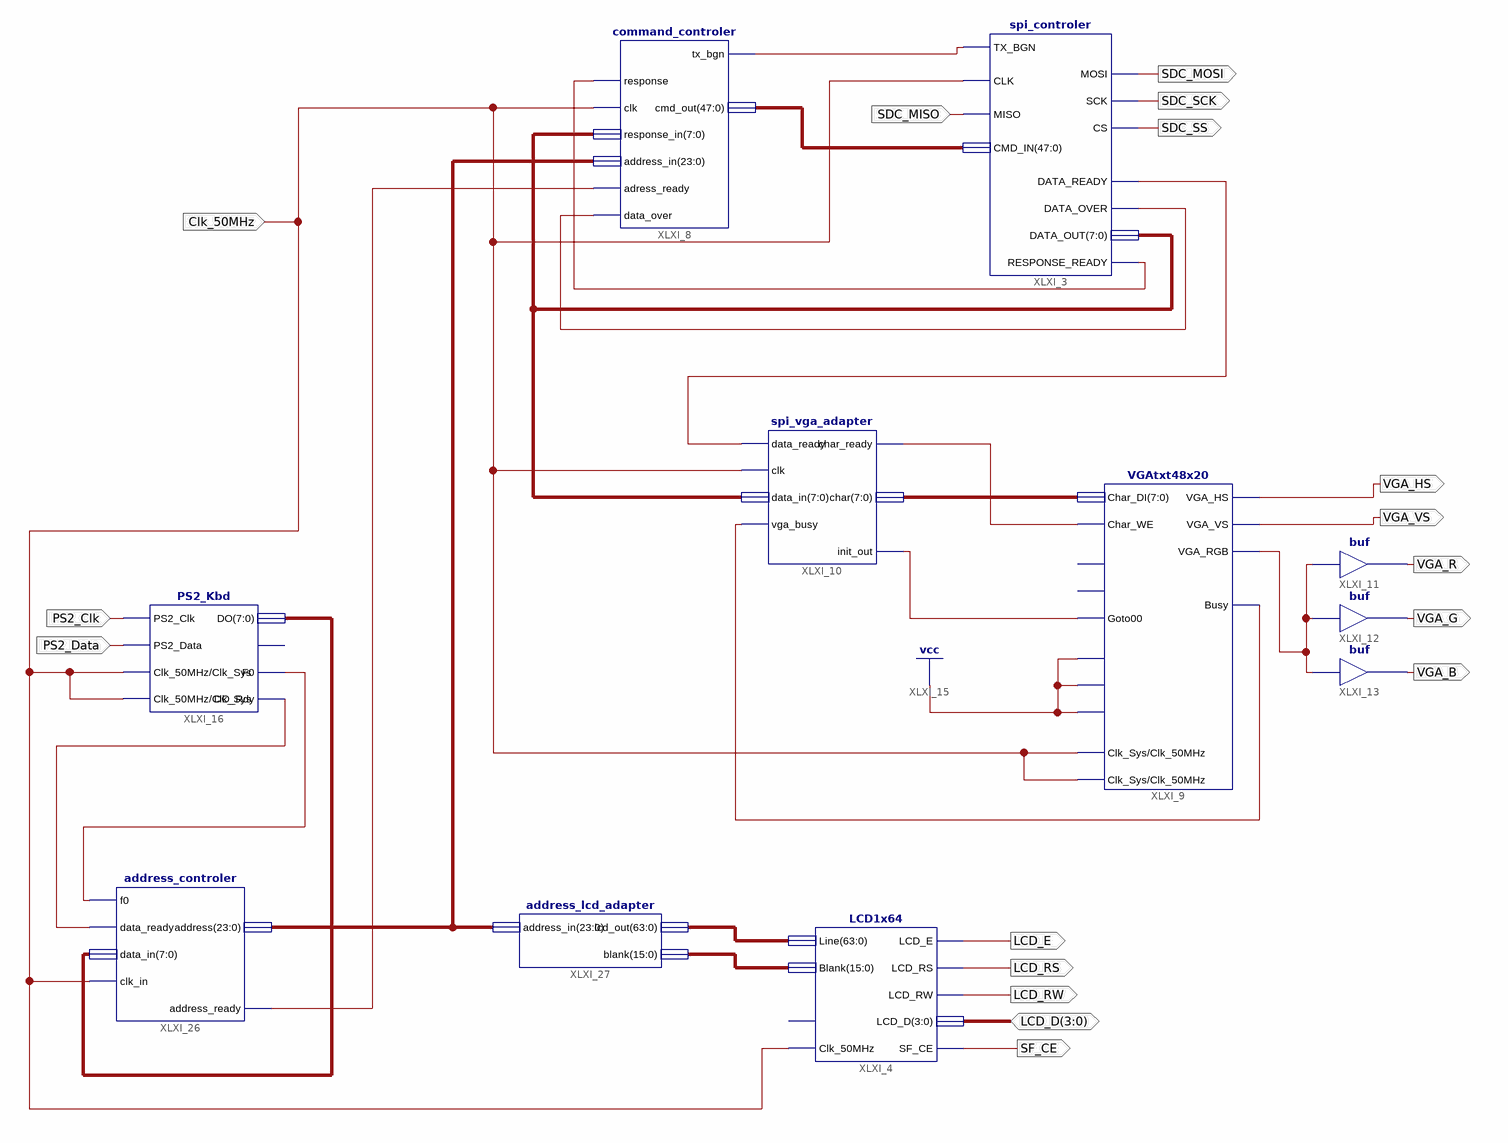
[diagram p0: schematic sheet 1]
// Xilinx ISE schematic main_full.sch (spartan3e) as structural Verilog: 11 symbols, 17 ports
module main_full (
  input  Clk_50MHz,
  input  SDC_MISO,
  input  PS2_Data,
  input  PS2_Clk,
  inout  [3:0] LCD_D,
  output VGA_B,
  output VGA_G,
  output VGA_R,
  output VGA_VS,
  output VGA_HS,
  output SDC_SS,
  output SDC_SCK,
  output SDC_MOSI,
  output LCD_E,
  output LCD_RS,
  output LCD_RW,
  output SF_CE
);

  wire XLXN_44, XLXN_52, XLXN_62, XLXN_169, XLXN_187, XLXN_229, XLXN_230, XLXN_232, XLXN_233, XLXN_284,
       XLXN_285;
  wire [7:0] XLXN_23, XLXN_45, XLXN_234;
  wire [15:0] XLXN_25;
  wire [23:0] XLXN_327;
  wire [47:0] XLXN_186;
  wire [63:0] XLXN_24;

  buf XLXI_12 (VGA_G, XLXN_52);
  buf XLXI_13 (VGA_B, XLXN_52);
  buf XLXI_11 (VGA_R, XLXN_52);
  VGAtxt48x20 XLXI_9 (
    .Char_DI(XLXN_45), .Goto00(XLXN_62), .Clk_Sys(Clk_50MHz), .Clk_50MHz(Clk_50MHz), .CursorOn(1'b1),
    .ScrollEn(1'b1), .ScrollClear(1'b1), .Busy(XLXN_169), .VGA_HS(VGA_HS), .VGA_VS(VGA_VS),
    .VGA_RGB(XLXN_52), .Char_WE(XLXN_44));  // open: Home, NewLine
  spi_vga_adapter XLXI_10 (
    .data_ready(XLXN_229), .vga_busy(XLXN_169), .clk(Clk_50MHz), .data_in(XLXN_23), .char_ready(XLXN_44),
    .char(XLXN_45), .init_out(XLXN_62));
  command_controler XLXI_8 (
    .response(XLXN_230), .adress_ready(XLXN_284), .data_over(XLXN_285), .clk(Clk_50MHz),
    .response_in(XLXN_23), .address_in(XLXN_327), .tx_bgn(XLXN_187), .cmd_out(XLXN_186));
  spi_controler XLXI_3 (
    .TX_BGN(XLXN_187), .CLK(Clk_50MHz), .MISO(SDC_MISO), .CMD_IN(XLXN_186), .RESPONSE_READY(XLXN_230),
    .DATA_READY(XLXN_229), .DATA_OVER(XLXN_285), .MOSI(SDC_MOSI), .SCK(SDC_SCK), .CS(SDC_SS),
    .DATA_OUT(XLXN_23));
  LCD1x64 XLXI_4 (
    .Clk_50MHz(Clk_50MHz), .Line(XLXN_24), .Blank(XLXN_25), .LCD_D(LCD_D), .LCD_E(LCD_E), .LCD_RW(LCD_RW),
    .LCD_RS(LCD_RS), .SF_CE(SF_CE));  // open: Reset
  address_controler XLXI_26 (
    .f0(XLXN_232), .data_ready(XLXN_233), .clk_in(Clk_50MHz), .data_in(XLXN_234), .address(XLXN_327),
    .address_ready(XLXN_284));
  address_lcd_adapter XLXI_27 (.address_in(XLXN_327), .lcd_out(XLXN_24), .blank(XLXN_25));
  PS2_Kbd XLXI_16 (
    .PS2_Clk(PS2_Clk), .PS2_Data(PS2_Data), .Clk_50MHz(Clk_50MHz), .F0(XLXN_232), .DO_Rdy(XLXN_233),
    .DO(XLXN_234), .Clk_Sys(Clk_50MHz));  // open: E0
endmodule
